# Altium schematic sheet GPIB.SchDoc
size A; SheetNumber: 3; SheetTotal: 6
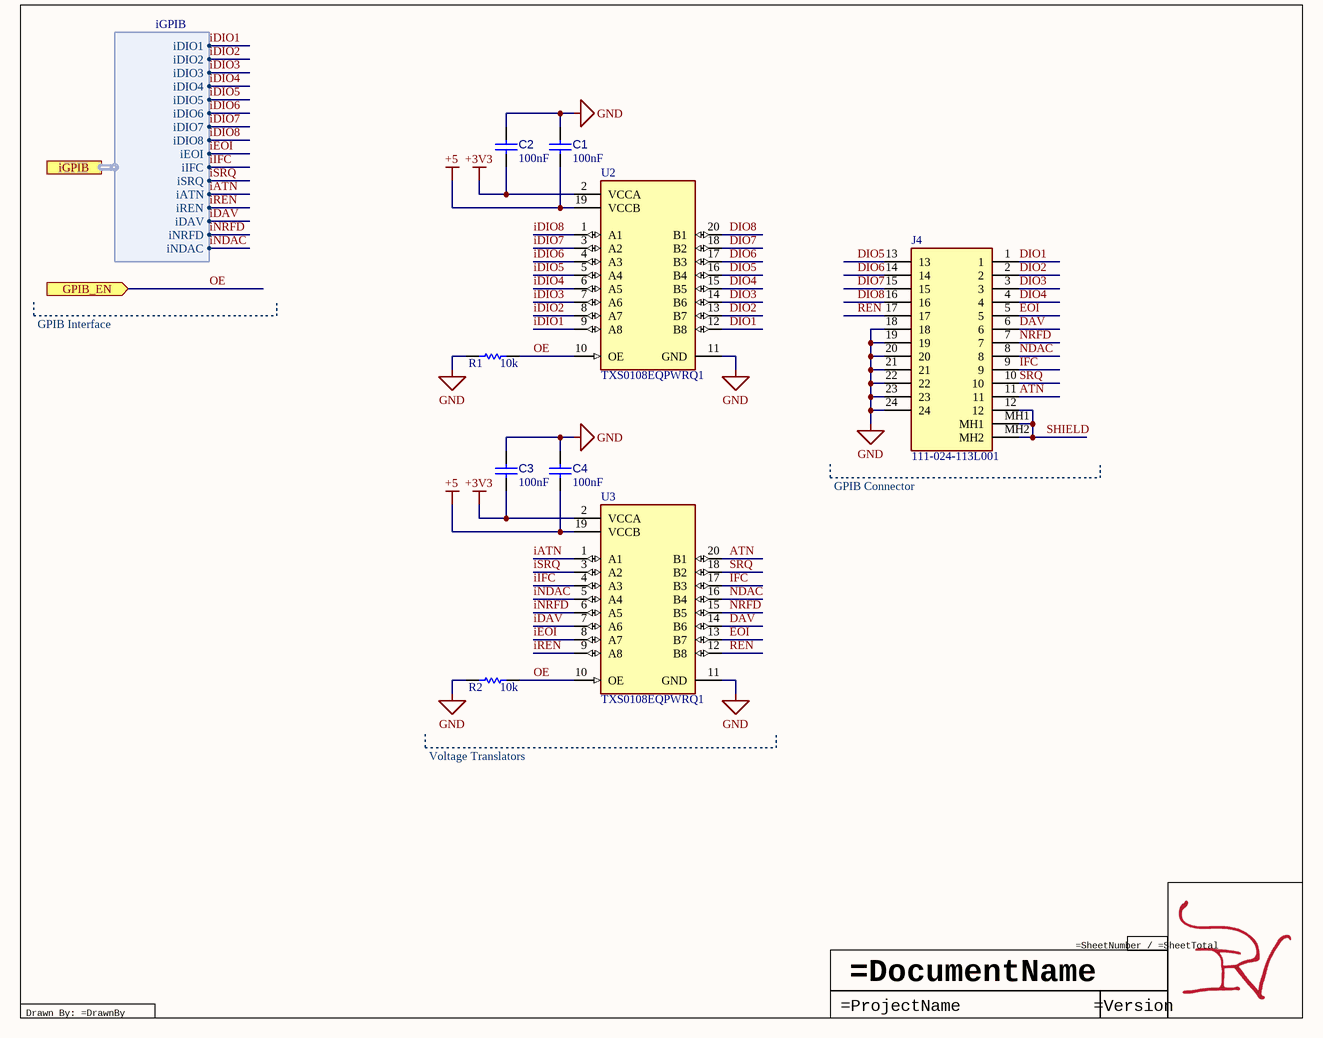
[diagram p0: GPIB.SchDoc]

## Parts
C1  value 100nF  [CAP 0402_1005]  (hidden comment: CAP-NP-2)
C2  value 100nF  [CAP 0402_1005]  (hidden comment: CAP-NP-2)
C3  value 100nF  [CAP 0402_1005]  (hidden comment: CAP-NP-2)
C4  value 100nF  [CAP 0402_1005]  (hidden comment: CAP-NP-2)
J4  111-024-113L001  [111024113L001]
R1  value 10k  [RES 0402_1005]  (hidden comment: 10K-0402-0.1/1)
R2  value 10k  [RES 0402_1005]  (hidden comment: 10K-0402-0.1/1)
U2  TXS0108EQPWRQ1  [FP-PW0020A-IPC_B]
U3  TXS0108EQPWRQ1  [FP-PW0020A-IPC_B]

## Ports
GPIB_EN (in), iGPIB (harness iGPIB)

## Harnesses
iGPIB: iEOI, iIFC, iSRQ, iATN, iREN, iDAV, iNRFD, iNDAC, iDIO8, iDIO7, iDIO6, iDIO5, iDIO4, iDIO3, iDIO2, iDIO1

## Nets
+3V3: C2.1 C3.1 U2.2(VCCA) U3.2(VCCA)
+5: C1.1 C4.1 U2.19(VCCB) U3.19(VCCB)
GND: C1.2 C2.2 C3.2 C4.2 J4.18 J4.19 J4.20 J4.21 J4.22 J4.23 J4.24 R1.1 R2.1 U2.11(GND) U3.11(GND)
ATN: J4.11 U3.20(B1)
DAV: J4.6 U3.14(B6)
DIO1: J4.1 U2.12(B8)
DIO2: J4.2 U2.13(B7)
DIO3: J4.3 U2.14(B6)
DIO4: J4.4 U2.15(B5)
DIO5: J4.13 U2.16(B4)
DIO6: J4.14 U2.17(B3)
DIO7: J4.15 U2.18(B2)
DIO8: J4.16 U2.20(B1)
EOI: J4.5 U3.13(B7)
iATN: U3.1(A1) ; port iGPIB.iATN
iDAV: U3.7(A6) ; port iGPIB.iDAV
iDIO1: U2.9(A8) ; port iGPIB.iDIO1
iDIO2: U2.8(A7) ; port iGPIB.iDIO2
iDIO3: U2.7(A6) ; port iGPIB.iDIO3
iDIO4: U2.6(A5) ; port iGPIB.iDIO4
iDIO5: U2.5(A4) ; port iGPIB.iDIO5
iDIO6: U2.4(A3) ; port iGPIB.iDIO6
iDIO7: U2.3(A2) ; port iGPIB.iDIO7
iDIO8: U2.1(A1) ; port iGPIB.iDIO8
iEOI: U3.8(A7) ; port iGPIB.iEOI
IFC: J4.9 U3.17(B3)
iIFC: U3.4(A3) ; port iGPIB.iIFC
iNDAC: U3.5(A4) ; port iGPIB.iNDAC
iNRFD: U3.6(A5) ; port iGPIB.iNRFD
iREN: U3.9(A8) ; port iGPIB.iREN
iSRQ: U3.3(A2) ; port iGPIB.iSRQ
NDAC: J4.8 U3.16(B4)
NRFD: J4.7 U3.15(B5)
OE: R1.2 R2.2 U2.10(OE) U3.10(OE) ; port GPIB_EN
REN: J4.17 U3.12(B8)
SHIELD: J4.12 J4.MH1 J4.MH2
SRQ: J4.10 U3.18(B2)

## Notes on the sheet
- GPIB Interface
- (near J4) GPIB Connector
- Voltage Translators
- Drawn By: =DrawnBy
- =DocumentName
- =ProjectName

## Library data of the parts
C1-C4 = CMP-00000-4: Ceramic Capacitor, Multilayer, Ceramic, 10V, 10% +Tol, 10% -Tol, X7R, 15% TC, 0.1uF, Surface Mount, 0402; Multilayer: Yes; Conflict Mineral: DRC Conflict Undeterminable; Global PFAS Assessment Status: Not Affected; Green: Compliant; NAS411: Affected; Rare Earth Element Information: Rare Earth Free; Capacitor Type: Ceramic; Case/Package: 0402; Dielectric Material: Ceramic; JESD-609 Code: e3; Max Operating Temperature: 125°C; Min Operating Temperature: -55°C; Mounting Technology: Surface Mount; Package Shape: Rectangular; Packaging: Tape and Reel; Pins: 2; Rated DC Voltage (URdc): 10V; Reach SVHC Compliant: Yes; RoHS Compliant: Yes; Temperature Characteristics Code: X7R; Terminal Finish: Nickel; Termination: Wraparound; Tolerance  (fill in as +-): 10%; Tolerance (fill in as +-): 10%; Tolerance: 10%; Voltage Rating: 10V; China RoHS Status: Unaffected; ELV: Compliant; EU SVHC List Version: Jan 23, 2024; Halogen Free: Compliant; Lead Free: Compliant; Persistent Organic Pollutants (POPs): Not Affected; REACH(SVHC) Information: Unaffected; RoHS Status: Yes; RoHS Version: 2011/65/EU, 2015/863; TSCA: Compliant; Capacitance: 100nF; Case Code (Imperial): 0402; Case Code (Metric): 1005; Construction: Flat; Contact Plating: Tin; Depth: 0.5mm; Dielectric: X7R; Height: 0.5mm; Length: 1mm; Mount: Surface Mount; Package Quantity: 1; Package Style: SMTMeter; Radiation Hardening: No; Series: CL; Thickness: 0.022inch; Width: 0.5mm
J4 = CMP-002-00009-2: Telecom and Datacom Connector; Manufacturer_Name: NorComp; Global PFAS Assessment Status: Not Affected; Conflict Mineral: DRC Conflict Free; Green: Unknown; TSCA: Compliant; Manufacturer_Part_Number: 111-024-113L001; Lead Free: Unknown; Persistent Organic Pollutants (POPs): Compliant; Design Item ID: 111-024-113L001; Halogen Free: Unknown; Height: 12.55mm; RoHS Status: Yes; Datasheet Link: https://componentsearchengine.com/Datasheets/2/111-024-113L001.pdf; Mouser Part Number: 636-111-024-113L001; RoHS Version: 2011/65/EU; REACH(SVHC) Information: Unaffected; EU SVHC List Version: Jan 15, 2018; ELV: Unknown; Mouser Price/Stock: https://www.mouser.co.uk/ProductDetail/NorComp/111-024-113L001?qs=IGgAdOvCTsTzuqCRtmjabw%3D%3D; Source: SamacSys.SchLib
R1 R2 = CMP-009-00033-2: Fixed Resistor, Metal Glaze/thick Film, 0.1W, 10000ohm, 50V, 1% +/-Tol, 100ppm/Cel, Surface Mount, 0402; Power: 100mW; Conflict Mineral: DRC Conflict Undeterminable; Global PFAS Assessment Status: Not Affected; Green: Not Compliant; NAS411: Affected; Package Height: 0.35mm; Package Length: 1mm; Package Width: 0.5mm; Persistent Organic Pollutants (POPs): Compliant; Rare Earth Element Information: Rare Earth Free; Rated Temperature: 70°C; Reference Standard: AEC-Q200; Temperature Coefficient: 100ppm/°C; Tolerance: 1%; Mounting Technology: Surface Mount; Min Operating Temperature: -55°C; Max Operating Temperature: 155°C; Pins: 2; RoHS Compliant: Yes; Case/Package: 0402; China RoHS Status: Affected; Construction: Rectangular; ELV: Not Compliant; EU SVHC List Version: Jan 23, 2024; Halogen Free: Compliant; JESD-609 Code: e3; Lead Free: Not Compliant; Package Shape: Rectangular; Package Style: SMTMeter; Packaging: Tape and Reel; REACH(SVHC) Information: Unaffected; Reach SVHC Compliant: Yes; Resistor Type: FIXED RESISTOR; RoHS Status: Yes with Exemption; RoHS Version: 2011/65/EU, 2015/863; Technology: METAL GLAZE/THICK FILM; Terminal Finish: Nickel; Termination: Wraparound; TSCA: Compliant; Working Voltage: 50V
U2 U3 = CMP-015-00001-1: Interface Circuit, PDSO20; Green: Compliant; Max Supply Voltage: 3.6V; Conflict Mineral: DRC Conflict Free; Min Supply Voltage: 1.4V; Rare Earth Element Information: Contain Rare Earth Element; Package Body Material: Plastic; Package Equivalence Code: TSSOP20,.25; Global PFAS Assessment Status: Not Affected; Nominal Supply Voltage: 1.5V; NAS411: Affected; Channels: 8; Reach SVHC Compliant: Yes; Package Style: SMALL OUTLINE, THIN PROFILE, SHRINK PITCHMeter; JESD-30 Code: R-PDSO-G20; Persistent Organic Pollutants (POPs): Compliant; Moisture Sensitivity Level: 1; Temperature Grade: AUTOMOTIVE; Height - Seated (Max): 1.2mm; Case/Package: TSSOP; RoHS Compliant: Yes; TSCA: Compliant; China RoHS Status: Unaffected; RoHS Version: 2011/65/EU, 2015/863; Terminal Pitch: 0.65mm; Terminal Form: Gull Wing; RoHS Status: Yes; Terminal Position: DUAL; Package Shape: Rectangular; REACH(SVHC) Information: Unaffected; Terminal Finish: Nickel; Max Operating Temperature: 125°C; Interface IC Type: INTERFACE CIRCUIT; Pins: 20; Width: 4.4mm; EU SVHC List Version: Jan 23, 2024; JESD-609 Code: e4; Halogen Free: Compliant; ELV: Compliant; Surface Mount: Yes; Min Operating Temperature: -40°C; Length: 6.5mm; Lead Free: Compliant